# Altium schematic sheet mini-inverter.SchDoc
size A1; SheetNumber: 1; SheetTotal: 5
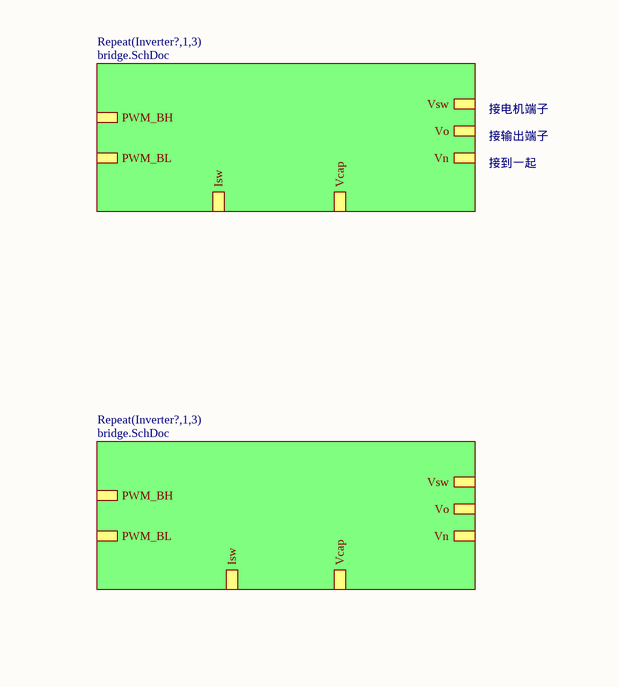
[diagram p0: mini-inverter.SchDoc, top left]
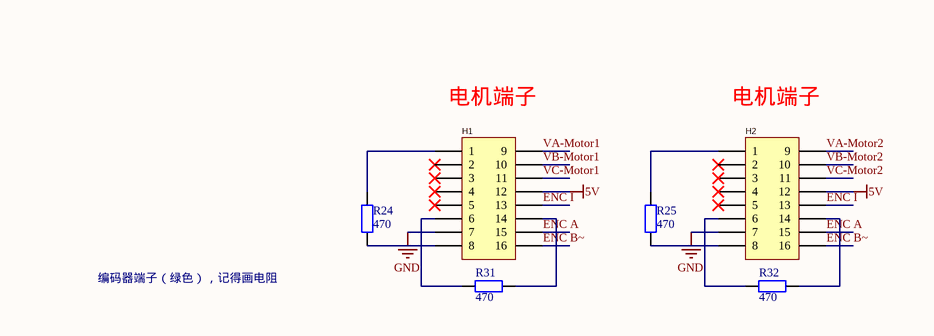
[diagram p1: mini-inverter.SchDoc, top right]
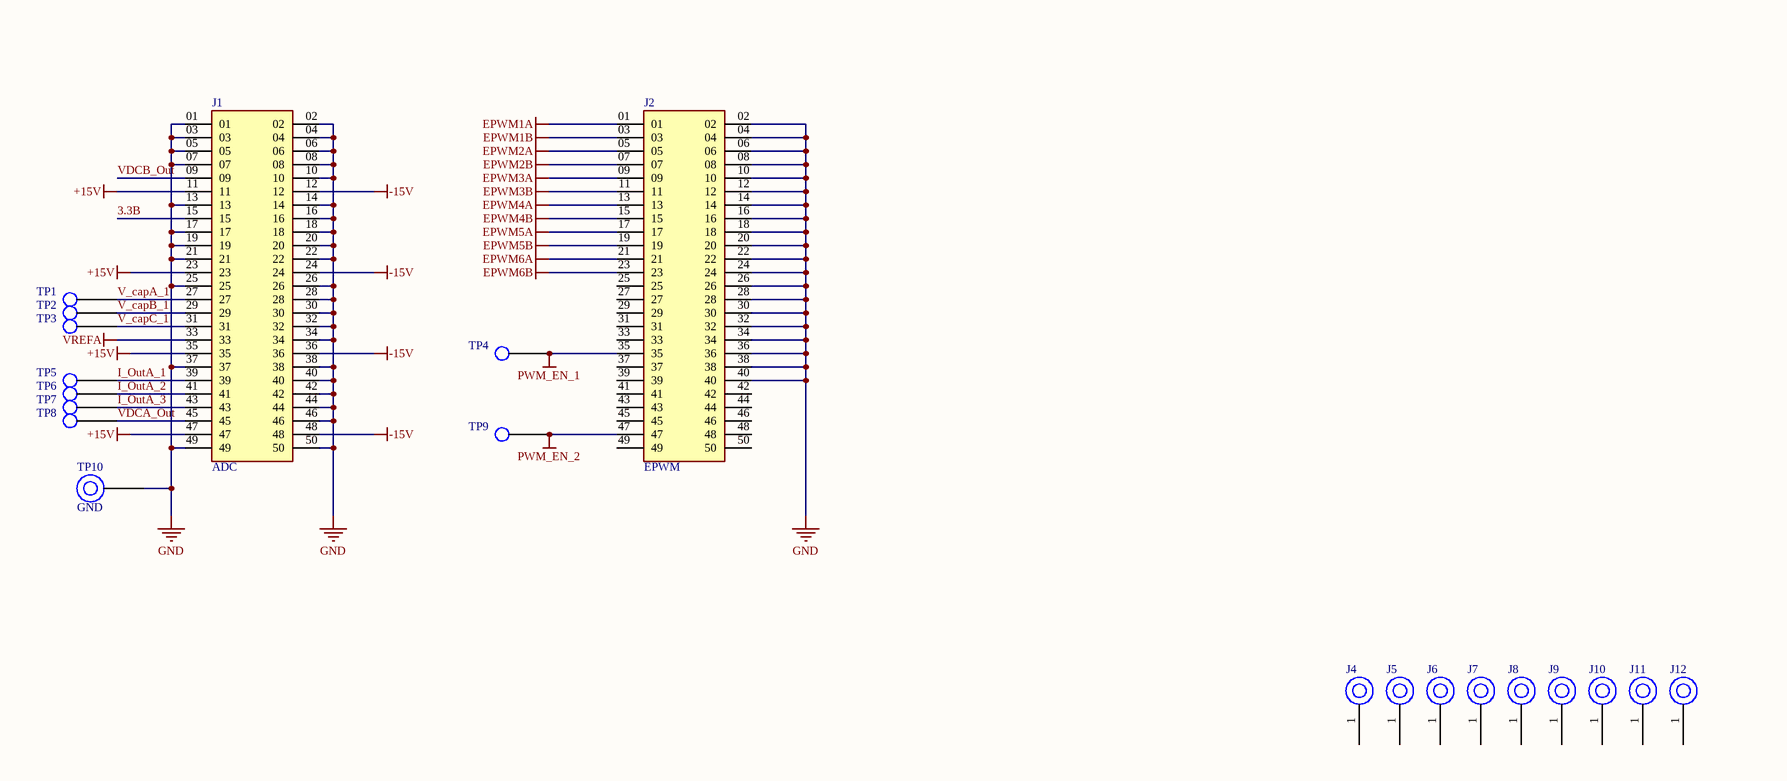
[diagram p2: mini-inverter.SchDoc, bottom left]
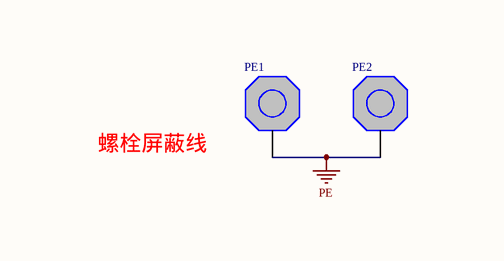
[diagram p3: mini-inverter.SchDoc, bottom right]

## Parts
H1  HC-5557-2*8AW  [CONN-TH_16P-P4.20_5557-2X8AW]  (value not drawn)
H2  HC-5557-2*8AW  [CONN-TH_16P-P4.20_5557-2X8AW]  (value not drawn)
J1  ADC  [SHF-125-01-L-D-RA]
J2  EPWM  [SHF-125-01-L-D-RA]
J4  M5 Mounting Hole  [M5 Mounting Hole]  (value not drawn)
J5  M5 Mounting Hole  [M5 Mounting Hole]  (value not drawn)
J6  M5 Mounting Hole  [M5 Mounting Hole]  (value not drawn)
J7  M5 Mounting Hole  [M5 Mounting Hole]  (value not drawn)
J8  M5 Mounting Hole  [M5 Mounting Hole]  (value not drawn)
J9  M5 Mounting Hole  [M5 Mounting Hole]  (value not drawn)
J10  M5 Mounting Hole  [M5 Mounting Hole]  (value not drawn)
J11  M5 Mounting Hole  [M5 Mounting Hole]  (value not drawn)
J12  M5 Mounting Hole  [M5 Mounting Hole]  (value not drawn)
PE1  PE  [PE1]  (value not drawn)
PE2  PE  [PE1]  (value not drawn)
R24  470  [RESC1608X05N]
R25  470  [RESC1608X05N]
R31  470  [RESC1608X05N]
R32  470  [RESC1608X05N]
TP1  VC_1A  [PCB 1.32mm TestPoint]  (value not drawn)
TP2  VC_1B  [PCB 1.32mm TestPoint]  (value not drawn)
TP3  VC_1C  [PCB 1.32mm TestPoint]  (value not drawn)
TP4  PWMEN1  [PCB 1.32mm TestPoint]  (value not drawn)
TP5  I1  [PCB 1.32mm TestPoint]  (value not drawn)
TP6  I2  [PCB 1.32mm TestPoint]  (value not drawn)
TP7  I3  [PCB 1.32mm TestPoint]  (value not drawn)
TP8  VDC  [PCB 1.32mm TestPoint]  (value not drawn)
TP9  PWMEN2  [PCB 1.32mm TestPoint]  (value not drawn)
TP10  GND  [1.9mm Hole]

## Sub-sheets
Repeat(Inverter?,1,3) = bridge.SchDoc: PWM_BH, PWM_BL, Vsw, Vo, Vn, Vcap, Isw
Repeat(Inverter?,1,3) = bridge.SchDoc: PWM_BH, PWM_BL, Vsw, Vo, Vn, Vcap, Isw

## Nets
5V: H1.8(12) H2.8(12)
+15V: J1.11 J1.23 J1.35 J1.47
-15V: J1.12 J1.24 J1.36 J1.48
EPWM1A: J2.01
EPWM1B: J2.03
EPWM2A: J2.05
EPWM2B: J2.07
EPWM3A: J2.09
EPWM3B: J2.11
EPWM4A: J2.13
EPWM4B: J2.15
EPWM5A: J2.17
EPWM5B: J2.19
EPWM6A: J2.21
EPWM6B: J2.23
GND: H1.13(7) H2.13(7) J1.01 J1.02 J1.03 J1.04 J1.05 J1.06 J1.07 J1.08 J1.10 J1.13 J1.14 J1.16 J1.17 J1.18 J1.19 J1.20 J1.21 J1.22 J1.25 J1.26 J1.28 J1.30 J1.32 J1.34 J1.37 J1.38 J1.40 J1.42 J1.44 J1.46 J1.49 J1.50 J2.02 J2.04 J2.06 J2.08 J2.10 J2.12 J2.14 J2.16 J2.18 J2.20 J2.22 J2.24 J2.26 J2.28 J2.30 J2.32 J2.34 J2.36 J2.38 J2.40 TP10.1
PE: PE1.1(PE) PE2.1(PE)
PWM_EN_1: J2.35 TP4.1
PWM_EN_2: J2.47 TP9.1
VREFA: J1.33
3.3B: J1.15
ENC A: H1.14(15) H2.14(15)
ENC B~: H1.16 H2.16
ENC I: H1.10(13) H2.10(13)
I_OutA_1: J1.39 TP5.1
I_OutA_2: J1.41 TP6.1
I_OutA_3: J1.43 TP7.1
V_capA_1: J1.27 TP1.1
V_capB_1: J1.29 TP2.1
V_capC_1: J1.31 TP3.1
VA-Motor1: H1.2(9)
VA-Motor2: H2.2(9)
VB-Motor1: H1.4(10)
VB-Motor2: H2.4(10)
VC-Motor1: H1.6(11)
VC-Motor2: H2.6(11)
VDCA_Out: J1.45 TP8.1
VDCB_Out: J1.09
NetH1_1: H1.1 R24.2
NetH1_11: H1.11(6) R31.2
NetH1_12: H1.12(14) R31.1
NetH1_15: H1.15(8) R24.1
NetH2_1: H2.1 R25.2
NetH2_11: H2.11(6) R32.2
NetH2_12: H2.12(14) R32.1
NetH2_15: H2.15(8) R25.1

Not connected (* = marked no-connect by the designer): H1 3(2)* 5(3)* 7(4)* 9(5)*; H2 3(2)* 5(3)* 7(4)* 9(5)*; J2 25 27 29 31 33 37 39 41 42 43 44 45 46 48 49 50; J4 1; J5 1; J6 1; J7 1; J8 1; J9 1; J10 1; J11 1; J12 1

## Notes on the sheet
- 接输出端子
- 接电机端子
- 接到一起
- (near H1) 电机端子
- (near H2) 电机端子
- 编码器端子（绿色），记得画电阻
- 螺栓屏蔽线

## Library data of the parts
H1 H2 = HC-5557-2*8AW: Manufacturer: HCTL(华灿天禄); Add into BOM: yes; Pins Structure: 2x8P; Pitch: 4.2mm; Number of PINs Per Row: 8; Current Rating (Max): 9A; Symbol: HC-5557-2*8AW; Device: HC-5557-2*8AW; LCSC Part Name: 2x8P 间距:4.2mm 弯插; Supplier Part: C2845793; Manufacturer Part: HC-5557-2*8AW; Supplier Footprint: 弯插,P=4.2mm; JLCPCB Part Class: Extended Part; Datasheet: https://atta.szlcsc.com/upload/public/pdf/source/20230620/3AA4118B2C2E81189EA8FE45B17A7E9B.pdf; Supplier: LCSC; Convert to PCB: yes; Mounting Style: 弯插; Reference Series: -; Number of Pins: 16P; Number of Rows: 2; Row Spacing: 4.2mm; Contact Material: 黄铜; Contact Plating: 锡; Operating Temperature Range: -25℃~+85℃
J1 J2 = SHF-125-01-L-D-RA: 50-Pin Simplus Connector; MF: Samtec; MP: SHF-125-01-L-D-RA; Package: None; Price: None; Availability: Unavailable; Value: *
R24 R25 R31 R32 = 0603 100KΩ (1003) 1%_4: 贴片电阻; Value: 470Ω(1%); ComponentLink1Description: 供应商链接; ComponentLink1URL: http://www.szlcsc.com/product/details_26546.html; Package: 0603; Supplier: LC; SuppliersPartNumber: C25803
TP1-TP9 = PCBTestpoint: 20-313143 PCB Test Point, White, Through Hole Mount, 1.32 mm, Phosphor Bronze, Tin Plated Contacts
TP10 = GroundTestPoint: H2182-01 PCB Test Point, PCB Mount, 1.9 mm, Brass, Tin Plated Contacts